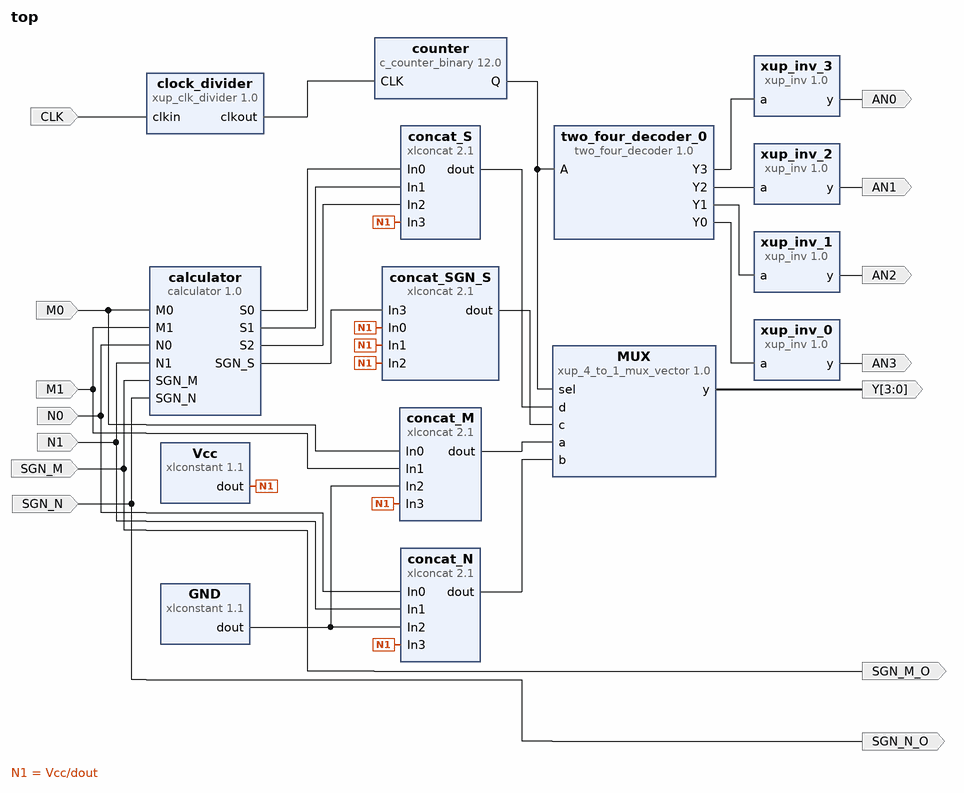
[diagram p0: block diagram of the top level]
# Vivado block design top, xc7a35tcpg236-1, Vivado 2016.3
create_bd_design top

create_bd_port -dir I M0
create_bd_port -dir I M1
create_bd_port -dir I N0
create_bd_port -dir I N1
create_bd_port -dir I SGN_M
create_bd_port -dir I SGN_N
create_bd_port -dir O -from 3 -to 0 Y
create_bd_port -dir O AN3
create_bd_port -dir O AN2
create_bd_port -dir O AN1
create_bd_port -dir O AN0
create_bd_port -dir I CLK
create_bd_port -dir O SGN_M_O
create_bd_port -dir O SGN_N_O

create_bd_cell -type ip -vlnv xilinx.com:user:calculator:1.0 calculator
create_bd_cell -type ip -vlnv xilinx.com:xup:xup_4_to_1_mux_vector:1.0 MUX
create_bd_cell -type ip -vlnv xilinx.com:ip:xlconcat:2.1 concat_S
set_property -dict {CONFIG.NUM_PORTS 4} [get_bd_cells concat_S]
create_bd_cell -type ip -vlnv xilinx.com:ip:xlconstant:1.1 Vcc
create_bd_cell -type ip -vlnv xilinx.com:ip:xlconcat:2.1 concat_SGN_S
set_property -dict {CONFIG.NUM_PORTS 4} [get_bd_cells concat_SGN_S]
create_bd_cell -type ip -vlnv xilinx.com:ip:xlconcat:2.1 concat_M
set_property -dict {CONFIG.NUM_PORTS 4} [get_bd_cells concat_M]
create_bd_cell -type ip -vlnv xilinx.com:ip:xlconstant:1.1 GND
set_property -dict {CONFIG.CONST_VAL 0} [get_bd_cells GND]
create_bd_cell -type ip -vlnv xilinx.com:ip:xlconcat:2.1 concat_N
set_property -dict {CONFIG.NUM_PORTS 4} [get_bd_cells concat_N]
create_bd_cell -type ip -vlnv xilinx.com:ip:c_counter_binary:12.0 counter
set_property -dict {CONFIG.Output_Width 2} [get_bd_cells counter]
create_bd_cell -type ip -vlnv xilinx.com:xup:xup_clk_divider:1.0 clock_divider
set_property -dict {CONFIG.SIZE 400000} [get_bd_cells clock_divider]
create_bd_cell -type ip -vlnv xilinx.com:user:two_four_decoder:1.0 two_four_decoder_0
create_bd_cell -type ip -vlnv xilinx.com:xup:xup_inv:1.0 xup_inv_0
create_bd_cell -type ip -vlnv xilinx.com:xup:xup_inv:1.0 xup_inv_1
create_bd_cell -type ip -vlnv xilinx.com:xup:xup_inv:1.0 xup_inv_2
create_bd_cell -type ip -vlnv xilinx.com:xup:xup_inv:1.0 xup_inv_3

# ---- connections ----

connect_bd_net -net M0_1 [get_bd_ports M0] [get_bd_pins calculator/M0] [get_bd_pins concat_M/In0]
connect_bd_net -net M1_1 [get_bd_ports M1] [get_bd_pins calculator/M1] [get_bd_pins concat_M/In1]
connect_bd_net -net N0_1 [get_bd_ports N0] [get_bd_pins calculator/N0] [get_bd_pins concat_N/In0]
connect_bd_net -net N1_1 [get_bd_ports N1] [get_bd_pins calculator/N1] [get_bd_pins concat_N/In1]
connect_bd_net [get_bd_ports SGN_M] [get_bd_pins calculator/SGN_M] [get_bd_ports SGN_M_O]
connect_bd_net [get_bd_ports SGN_N] [get_bd_pins calculator/SGN_N] [get_bd_ports SGN_N_O]
connect_bd_net -net calculator_0_S0 [get_bd_pins calculator/S0] [get_bd_pins concat_S/In0]
connect_bd_net -net calculator_0_S1 [get_bd_pins calculator/S1] [get_bd_pins concat_S/In1]
connect_bd_net -net calculator_0_S2 [get_bd_pins calculator/S2] [get_bd_pins concat_S/In2]
connect_bd_net -net xlconcat_0_dout [get_bd_pins concat_S/dout] [get_bd_pins MUX/d]
connect_bd_net -net xlconstant_0_dout [get_bd_pins Vcc/dout] \
  [get_bd_pins concat_S/In3] [get_bd_pins concat_SGN_S/In2] [get_bd_pins concat_SGN_S/In1] [get_bd_pins concat_SGN_S/In0] \
  [get_bd_pins concat_M/In3] [get_bd_pins concat_N/In3]
connect_bd_net -net xlconcat_1_dout [get_bd_pins concat_SGN_S/dout] [get_bd_pins MUX/c]
connect_bd_net -net calculator_0_SGN_S [get_bd_pins calculator/SGN_S] [get_bd_pins concat_SGN_S/In3]
connect_bd_net -net xlconstant_1_dout [get_bd_pins GND/dout] [get_bd_pins concat_M/In2] [get_bd_pins concat_N/In2]
connect_bd_net -net xlconcat_2_dout [get_bd_pins concat_M/dout] [get_bd_pins MUX/a]
connect_bd_net [get_bd_pins concat_N/dout] [get_bd_pins MUX/b]
connect_bd_net [get_bd_pins counter/Q] [get_bd_pins MUX/sel] [get_bd_pins two_four_decoder_0/A]
connect_bd_net [get_bd_pins MUX/y] [get_bd_ports Y]
connect_bd_net [get_bd_pins two_four_decoder_0/Y0] [get_bd_pins xup_inv_0/a]
connect_bd_net [get_bd_pins xup_inv_0/y] [get_bd_ports AN3]
connect_bd_net [get_bd_pins two_four_decoder_0/Y1] [get_bd_pins xup_inv_1/a]
connect_bd_net [get_bd_pins xup_inv_1/y] [get_bd_ports AN2]
connect_bd_net [get_bd_pins two_four_decoder_0/Y2] [get_bd_pins xup_inv_2/a]
connect_bd_net [get_bd_pins xup_inv_2/y] [get_bd_ports AN1]
connect_bd_net [get_bd_pins two_four_decoder_0/Y3] [get_bd_pins xup_inv_3/a]
connect_bd_net [get_bd_pins xup_inv_3/y] [get_bd_ports AN0]
connect_bd_net [get_bd_ports CLK] [get_bd_pins clock_divider/clkin]
connect_bd_net [get_bd_pins clock_divider/clkout] [get_bd_pins counter/CLK]

validate_bd_design
save_bd_design
